# Altium schematic sheet VoltageFeedbackSwitch.SchDoc
size A3
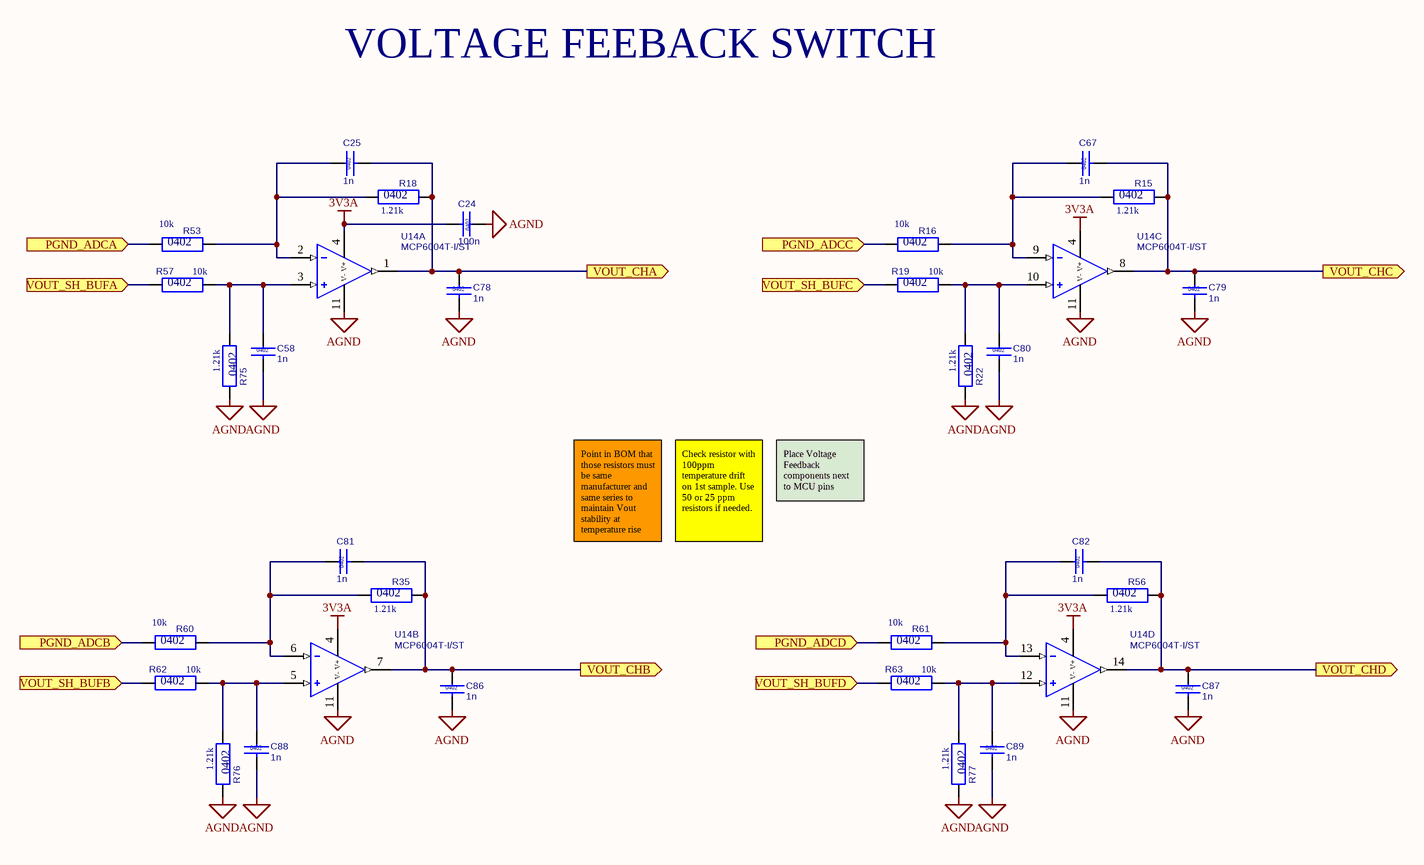
[diagram p0: VoltageFeedbackSwitch.SchDoc]

## Parts
C24  100n  Case: 0402  [CC0402M]
C25  1n  Case: 0402  [CC0402M]
C58  1n  Case: 0402  [CC0402M]
C67  1n  Case: 0402  [CC0402M]
C78  1n  Case: 0402  [CC0402M]
C79  1n  Case: 0402  [CC0402M]
C80  1n  Case: 0402  [CC0402M]
C81  1n  Case: 0402  [CC0402M]
C82  1n  Case: 0402  [CC0402M]
C86  1n  Case: 0402  [CC0402M]
C87  1n  Case: 0402  [CC0402M]
C88  1n  Case: 0402  [CC0402M]
C89  1n  Case: 0402  [CC0402M]
R15  Case: 0402  [RC0402M]  (hidden comment: 1.21k)
R16  Case: 0402  [RC0402M]  (hidden comment: 10k)
R18  Case: 0402  [RC0402M]  (hidden comment: 1.21k)
R19  Case: 0402  [RC0402M]  (hidden comment: 10k)
R22  Case: 0402  [RC0402M]  (hidden comment: 1.21k)
R35  Case: 0402  [RC0402M]  (hidden comment: 1.21k)
R53  Case: 0402  [RC0402M]  (hidden comment: 10k)
R56  Case: 0402  [RC0402M]  (hidden comment: 1.21k)
R57  Case: 0402  [RC0402M]  (hidden comment: 10k)
R60  Case: 0402  [RC0402M]  (hidden comment: 10k)
R61  Case: 0402  [RC0402M]  (hidden comment: 10k)
R62  Case: 0402  [RC0402M]  (hidden comment: 10k)
R63  Case: 0402  [RC0402M]  (hidden comment: 10k)
R75  Case: 0402  [RC0402M]  (hidden comment: 1.21k)
R76  Case: 0402  [RC0402M]  (hidden comment: 1.21k)
R77  Case: 0402  [RC0402M]  (hidden comment: 1.21k)
U14  MCP6004T-I/ST  [TSSOP-14]  (parts A,B,C,D of 4)

## Ports
PGND_ADCA (in), PGND_ADCB (in), PGND_ADCC (in), PGND_ADCD (in), VOUT_CHA (out), VOUT_CHB (out), VOUT_CHC (out), VOUT_CHD (out), VOUT_SH_BUFA (in), VOUT_SH_BUFB (in), VOUT_SH_BUFC (in), VOUT_SH_BUFD (in)

## Nets
3V3A: C24.2 U14.4(V+)
AGND: C24.1 C58.2 C78.2 C79.2 C80.2 C86.2 C87.2 C88.2 C89.2 R22.1 R75.1 R76.1 R77.1 U14.11(V-)
PGND_ADCA: R53.2 ; port PGND_ADCA
PGND_ADCB: R60.2 ; port PGND_ADCB
PGND_ADCC: R16.2 ; port PGND_ADCC
PGND_ADCD: R61.2 ; port PGND_ADCD
VOUT_CHA: C25.2 C78.1 R18.1 U14.1(OUT1) ; port VOUT_CHA
VOUT_CHB: C81.2 C86.1 R35.1 U14.7(OUT2) ; port VOUT_CHB
VOUT_CHC: C67.2 C79.1 R15.1 U14.8(OUT3) ; port VOUT_CHC
VOUT_CHD: C82.2 C87.1 R56.1 U14.14(OUT4) ; port VOUT_CHD
VOUT_SH_BUFA: R57.2 ; port VOUT_SH_BUFA
VOUT_SH_BUFB: R62.2 ; port VOUT_SH_BUFB
VOUT_SH_BUFC: R19.2 ; port VOUT_SH_BUFC
VOUT_SH_BUFD: R63.2 ; port VOUT_SH_BUFD
NetC25_1: C25.1 R18.2 R53.1 U14.2(IN1-)
NetC58_1: C58.1 R57.1 R75.2 U14.3(IN1+)
NetC67_1: C67.1 R15.2 R16.1 U14.9(IN3-)
NetC80_1: C80.1 R19.1 R22.2 U14.10(IN3+)
NetC81_1: C81.1 R35.2 R60.1 U14.6(IN2-)
NetC82_1: C82.1 R56.2 R61.1 U14.13(IN4-)
NetC88_1: C88.1 R62.1 R76.2 U14.5(IN2+)
NetC89_1: C89.1 R63.1 R77.2 U14.12(IN4+)

## Notes on the sheet
- VOLTAGE FEEBACK SWITCH
- Point in BOM that those resistors must be same manufacturer and same series to maintain Vout stability at temperature rise
- Check resistor with 100ppm temperature drift on 1st sample. Use 50 or 25 ppm resistors if needed.
- Place Voltage Feedback components next to MCU pins

## Library data of the parts
C24 = CC0402K-X7R-25V-100N-M: Chip ceramic capacitor; Manufacturer PN: GRM155R71E104KE14J; Manufacturer: Murata; Tollerance: 10%; Rated Voltage: 25V; Material: X7R; PartNumber: CC0402K-X7R-25V-100N-M; Value: 100n; Publisher: alexey.savchenko; Publishing Date: 1/12/2020
C25 C58 C67 C80-C82 C88 C89 = CC0402J-NP0-50V-1N-M: Chip ceramic capacitor; Manufacturer PN: CL05C102JB5NNNC; Manufacturer: Samsung; Tollerance: 5%; Rated Voltage: 50V; Material: NP0; PartNumber: CC0402J-NP0-50V-1N-M; Value: 1n; Publisher: alexey.savchenko; Publishing Date: 2/27/2020
C78 C79 C86 C87 = CC0402K-X7R-50V-1N-M: Chip ceramic capacitor; Manufacturer PN: CC0402KRX7R9BB102; Manufacturer: Yageo; Tollerance: 10%; Rated Voltage: 50V; Material: X7R; PartNumber: CC0402K-X7R-50V-1N-M; Value: 1n; Publisher: alexey.savchenko; Publishing Date: 2/27/2020
R15 R18 R22 R35 R56 R75-R77 = RC0402F-1K21-M: Chip resistor; Manufacturer PN: RC0402FR-071K21L; Manufacturer: Yageo; Tollerance: 1%; Rated Voltage: 50V; Power: 0.063W; T Coefficient: 100ppm; Value: 1.21k; PartNumber: RC0402F-1K21-M; Publisher: alexey.savchenko; Publishing Date: 12/7/2020
R16 R19 R53 R57 R60-R63 = RC0402F-10K-M: Chip resistor; Manufacturer PN: RC0402FR-0710KL; Manufacturer: Yageo; Tollerance: 1%; Rated Voltage: 50V; Power: 0.063W; Value: 10k; PartNumber: RC0402F-10K-M; Publisher: alexey.savchenko; Publishing Date: 2/24/2020
U14 = MCP6004T-I/ST: General Purpose Amplifier 4 Circuit Rail-to-Rail 14-TSSOP; Manufacturer: Microchip; PartNumber: MCP6004T-I/ST; Manufacturer PN: MCP6004T-I/ST; Case: TSSOP-14; Publisher: alexey.savchenko; Publishing Date: 4/9/2020